# Altium schematic sheet PowerMngt.SchDoc
size A
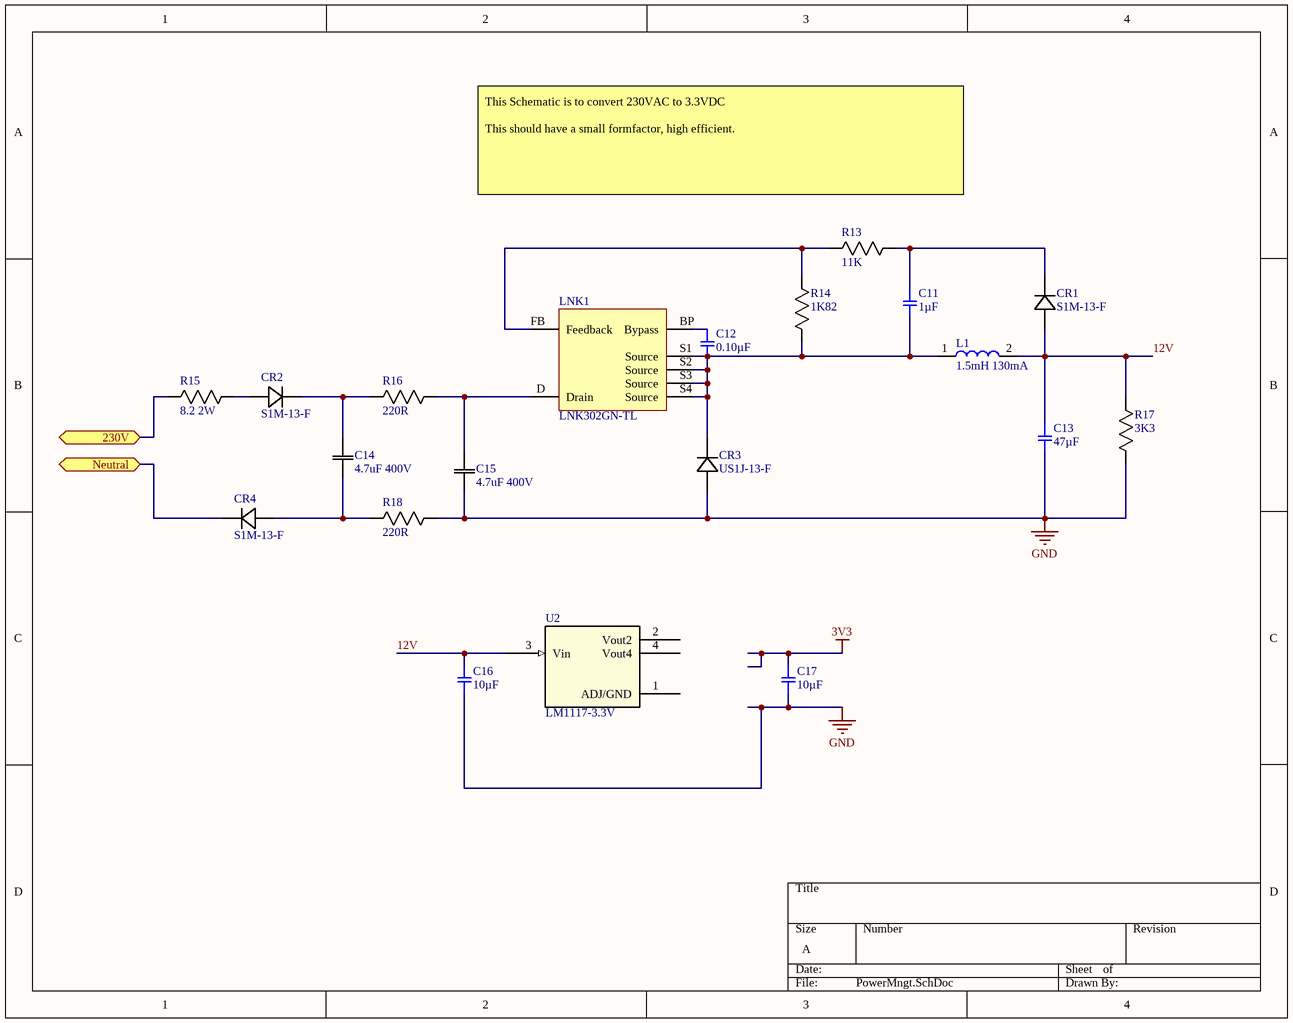
[diagram p0: PowerMngt.SchDoc]

## Parts
C11  1µF  [SMD-0603C]
C12  0.10µF  [SMD-0402C]
C13  47µF  [SMD-1210C]
C14  4.7uF 400V  [CAP_PAN_EEE_G17]
C15  4.7uF 400V  [CAP_PAN_EEE_G17]
C16  10µF  [SMD-0603C]
C17  10µF  [SMD-0603C]
CR1  S1M-13-F  [SMA]
CR2  S1M-13-F  [SMA]
CR3  US1J-13-F  [SMA]
CR4  S1M-13-F  [SMA]
L1  1.5mH 130mA  [AIAP-01]
LNK1  LNK302GN-TL  [SMD-8B]
R13  11K  [RC0805N]
R14  1K82  [RES_ERA6A_0805]
R15  8.2 2W  [RES_SMF2_TYCO]
R16  220R  [RC0805N]
R17  3K3  [RC0805N]
R18  220R  [RC0805N]
U2  LM1117-3.3V  [MP04A]

## Ports
230V (bidir), Neutral (bidir)

## Nets
3V3: C17.2
GND: C13.2 C15.1 C16.1 C17.1 CR3.2 R17.2 R18.1
12V: C13.1 C16.2 CR1.2 L1.2 R17.1 U2.3(Vin)
230V: R15.2 ; port 230V
Neutral: CR4.1 ; port Neutral
NetC11_1: C11.1 CR1.1 R13.1
NetC11_2: C11.2 C12.2 CR3.1 L1.1 LNK1.S1(Source) LNK1.S2(Source) LNK1.S3(Source) LNK1.S4(Source) R14.2
NetC12_1: C12.1 LNK1.BP(Bypass)
NetC14_1: C14.1 CR4.2 R18.2
NetC14_2: C14.2 CR2.1 R16.2
NetC15_2: C15.2 LNK1.D(Drain) R16.1
NetCR2_2: CR2.2 R15.1
NetLNK1_FB: LNK1.FB(Feedback) R13.2 R14.1

Not connected (* = marked no-connect by the designer): U2 1(ADJ/GND) 2(Vout2) 4(Vout4)

## Notes on the sheet
- This Schematic is to convert 230VAC to 3.3VDC
  This should have a small formfactor, high efficient.

## Library data of the parts
C11 = GRM188R61C105MA12D: CAP CER 1UF 16V X5R 0603; Manufacturer: Murata Electronics North America; Factory Stock: 0; Unit Price (USD): 0.1; Minimum Quantity: 1; Tolerance: ±20%; Datasheets: http://www.murata.com/~/media/webrenewal/support/library/catalog/products/capacitor/mlcc/c02e.pdf; Image: //media.digikey.com/Renders/Murata%20Renders/ZRB-SERIES-0402.jpg; Digi-Key Part Number: 490-10480-1-ND; Part Number: GRM188R61C105MA12D; Quantity Available: 3593; @ qty: 0; Packaging: Cut Tape (CT); Series: GRM; Part Status: Active; Value: 1µF; Voltage: 16V; Temperature Coefficient: X5R; Operating Temperature: -55°C ~ 85°C; Features: Derating Recommended; Ratings: -; Applications: General Purpose; Mounting Type: Surface Mount, MLCC; Package / Case: 0603 (1608 Metric); Size / Dimension: 0.063" L x 0.031" W (1.60mm x 0.80mm); Height - Seated (Max): -; Thickness (Max): 0.035" (0.90mm); Lead Spacing: -; Lead Style: -
C12 = GCM155R71C104KA55D: CAP CER 0.1UF 16V X7R 0402; Manufacturer: Murata Electronics North America; Factory Stock: 0; Unit Price (USD): 0.1; Minimum Quantity: 1; Tolerance: ±10%; Datasheets: http://www.murata.com/~/media/webrenewal/support/library/catalog/products/capacitor/mlcc/c03e.ashx; Image: //media.digikey.com/Renders/Murata%20Renders/ZRB-SERIES-0402.jpg; Digi-Key Part Number: 490-4759-1-ND; Part Number: GCM155R71C104KA55D; Quantity Available: 734194; @ qty: 0; Packaging: Cut Tape (CT); Series: GCM; Part Status: Active; Value: 0.10µF; Voltage: 16V; Temperature Coefficient: X7R; Operating Temperature: -55°C ~ 125°C; Features: -; Ratings: AEC-Q200; Applications: Automotive; Mounting Type: Surface Mount, MLCC; Package / Case: 0402 (1005 Metric); Size / Dimension: 0.039" L x 0.020" W (1.00mm x 0.50mm); Height - Seated (Max): -; Thickness (Max): 0.022" (0.55mm); Lead Spacing: -; Lead Style: -
C13 = GRM32EC81C476KE15L: CAP CER 47UF 16V X6S 1210; Manufacturer: Murata Electronics North America; Factory Stock: 0; Unit Price (USD): 0.73; Minimum Quantity: 1; Tolerance: ±10%; Datasheets: http://www.murata.com/~/media/webrenewal/support/library/catalog/products/capacitor/mlcc/c02e.pdf; Image: //media.digikey.com/Renders/Murata%20Renders/1210-32E.jpg; Digi-Key Part Number: 490-10531-1-ND; Part Number: GRM32EC81C476KE15L; Quantity Available: 396; @ qty: 0; Packaging: Cut Tape (CT); Series: GRM; Part Status: Active; Value: 47µF; Voltage: 16V; Temperature Coefficient: X6S; Operating Temperature: -55°C ~ 105°C; Features: Derating Recommended; Ratings: -; Applications: General Purpose; Failure Rate: Surface Mount, MLCC; Mounting Type: 1210 (3225 Metric); Package / Case: 0.126" L x 0.098" W (3.20mm x 2.50mm); Size / Dimension: -; Height - Seated (Max): 0.106" (2.70mm); Thickness (Max): -; Lead Spacing: -
C14 C15 = EEV-EB2G4R7Q: Imported; Vendor: Panasonic; Built_By: EMA_UL_Team; Type: DEV; C: Copyright (C) 2015 Accelerated Designs. All rights reserved; Manufacturer_Part_Number: EEV-EB2G4R7Q; RefDes: RefDes; Value: Value
C16 C17 = GRM188R60J106KE47D: CAP CER 10UF 6.3V X5R 0603; Manufacturer: Murata Electronics North America; Factory Stock: 0; Unit Price (USD): 0.13; Minimum Quantity: 1; Tolerance: ±10%; Datasheets: http://www.murata.com/~/media/webrenewal/support/library/catalog/products/capacitor/mlcc/c02e.pdf; Image: //media.digikey.com/Renders/Murata%20Renders/ZRB-SERIES-0402.jpg; Digi-Key Part Number: 490-12538-1-ND; Part Number: GRM188R60J106KE47D; Quantity Available: 3805; @ qty: 0; Packaging: Cut Tape (CT); Series: GRM; Part Status: Active; Value: 10µF; Voltage: 6.3V; Temperature Coefficient: X5R; Operating Temperature: -55°C ~ 85°C; Features: -; Ratings: -; Applications: General Purpose; Mounting Type: Surface Mount, MLCC; Package / Case: 0603 (1608 Metric); Size / Dimension: 0.063" L x 0.031" W (1.60mm x 0.80mm); Height - Seated (Max): -; Thickness (Max): 0.035" (0.90mm); Lead Spacing: -; Lead Style: -
CR1 CR2 CR4 = S1M-13-F: Imported; Vendor: Diodes Inc; Built_By: EMA_UL_Team; Type: DEV; C: Copyright (C) 2015 Accelerated Designs. All rights reserved; Manufacturer_Part_Number: S1M-13-F; RefDes: RefDes; Value: Value
CR3 = US1J-13-F: Imported; Vendor: Diodes Inc; Built_By: EMA_UL_Team; Type: DEV; C: Copyright (C) 2015 Accelerated Designs. All rights reserved; Manufacturer_Part_Number: US1J-13-F; RefDes: RefDes; Value: Value
L1 = AIAP-01-152K-T: Imported; Built_By: EMA_UL_Team; Vendor: Abracon; Type: DEV; Manufacturer_Part_Number: AIAP-01-152K-T; RefDes: RefDes; Value: Value
LNK1 = LNK302GN-TL: IC OFFLINE SWIT OCP 8SMD; Manufacturer: Power Integrations; Dynamic Catalog: AC DC Converters, Offline Switchers; Power (Watts): 12mW; Reference Design Library: DER-092: 4 LEDs @ 40mA, 0.5W, 85 ~ 265VAC in; Output Isolation: Non-Isolated; Frequency Range: 62kHz ~ 70kHz; Voltage - Breakdown: 700V; Other Names: 596-1020-2 / LNK302GNTL; Supplier 1: Digi-Key; Supplier Part Number 1: 596-1020-1-ND; Manufacturer Part Number: LNK302GN-TL; Stock 1: 53740; Pricing 1: 1=1.35, 10=1.193, 25=1.0776, 100=0.9428, 250=0.8273, 500=0.7311 (USD); Standard Package: 1,000; Category: Integrated Circuits (ICs); Family: PMIC - AC DC Converters, Offline Switchers; Series: LinkSwitch®-TN; Packaging: Tape & Reel (TR); Voltage - Input: -; Voltage - Output: -; Operating Temperature: -40°C ~ 150°C; Package / Case: 8-SMD (7 Leads), Gull Wing; Supplier Device Package: SMD-8B; Online Catalog: AC DC Converters, Offline Switchers; ComponentLink1URL: http://www.powerint.com/sites/default/files/product-docs/lnk302_304-306.pdf; ComponentLink1Description: http://www.powerint.com/sites/default/files/product-docs/lnk302_304-306.pdf; ComponentLink2URL: https://www.power.com/sites/default/files/product-docs/lnk302_304-306.pdf; ComponentLink2Description: https://www.power.com/sites/default/files/product-docs/lnk302_304-306.pdf; ComponentLink3URL: http://www.power.com/sites/default/files/product-docs/lnk302_304-306.pdf; ComponentLink3Description: http://www.power.com/sites/default/files/product-docs/lnk302_304-306.pdf
R13 = ERA-6AEB113V: Imported; Vendor: Panasonic; Built_By: EMA_UL_Team; C: Copyright (C) 2015 Accelerated Designs. All rights reserved; Manufacturer_Part_Number: ERA-6AEB113V; RefDes: RefDes; Type: DEV; Value: Value
R14 = ERA-6AEB1821V: Imported; Vendor: Panasonic; Built_By: EMA_UL_Team; C: Copyright (C) 2015 Accelerated Designs. All rights reserved; Manufacturer_Part_Number: ERA-6AEB1821V; RefDes: RefDes; Type: DEV; Value: Value
R15 = SMW28R2JT: Imported; Vendor: TE Connectivity; Built_By: EMA_UL_Team; C: Copyright (C) 2015 Accelerated Designs. All rights reserved; Manufacturer_Part_Number: SMW28R2JT; RefDes: RefDes; Type: DEV; Value: Value
R16 R18 = ERJ-P06J221V: Imported; Vendor: Panasonic; Built_By: EMA_UL_Team; C: Copyright (C) 2015 Accelerated Designs. All rights reserved; Manufacturer_Part_Number: ERJ-P06J221V; RefDes: RefDes; Type: DEV; Value: Value
R17 = ERA-6AEB332V: Imported; Vendor: Panasonic; Built_By: EMA_UL_Team; C: Copyright (C) 2015 Accelerated Designs. All rights reserved; Manufacturer_Part_Number: ERA-6AEB332V; RefDes: RefDes; Type: DEV; Value: Value
U2 = LM1117MPX-3.3/NO: Imported; Manufacturer_Part_Number: LM1117MPX-3.3/NOPB; Built_By: EMA_UL_Team; Vendor: National Semiconductor; RefDes: RefDes; Type: DEV; Value: Value